# Altium schematic sheet 09_Ebox_PhysicalConnections.SchDoc
size A4; DocumentNumber: 7; SheetNumber: 7; SheetTotal: 7
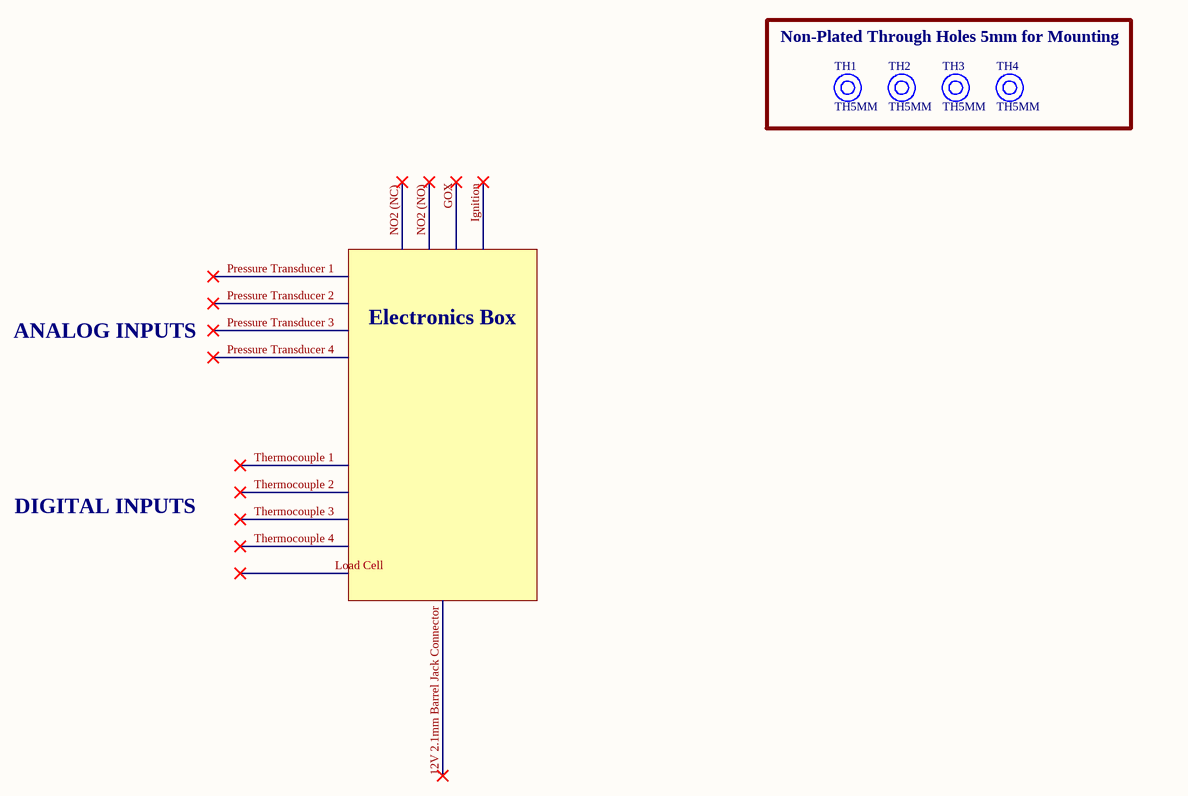
[diagram p0: 09_Ebox_PhysicalConnections.SchDoc]

## Parts
TH1  TH5MM  [Mounting Hole Non-Plated]
TH2  TH5MM  [Mounting Hole Non-Plated]
TH3  TH5MM  [Mounting Hole Non-Plated]
TH4  TH5MM  [Mounting Hole Non-Plated]

## Blocks framed on the sheet
Non-Plated Through Holes 5mm for Mounting: TH1-TH4

## Notes on the sheet
- NO2 (NC)
- NO2 (NO)
- GOX
- Ignition
- Pressure Transducer 1
- Pressure Transducer 2
- ANALOG INPUTS
- Pressure Transducer 3
- Pressure Transducer 4
- Electronics Box
- DIGITAL INPUTS
- Thermocouple 1
- Thermocouple 2
- Thermocouple 3
- Thermocouple 4
- Load Cell
- 12V 2.1mm Barrel Jack Connector
- Title:
- Company:
- Date:
- Sheet
- of
- Drawn By:

## Library data of the parts
TH1-TH4 = Mounting Hole Non-Plated: Non-plated THT 5mm diameter